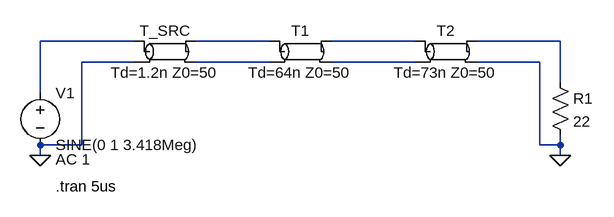
[diagram p0: schematic p3.asc]
p3.asc, the LTspice schematic file:
Version 4
SHEET 1 884 680
WIRE 176 224 32 224
WIRE 384 224 272 224
WIRE 608 224 480 224
WIRE 832 224 704 224
WIRE 176 256 96 256
WIRE 384 256 272 256
WIRE 608 256 480 256
WIRE 800 256 704 256
WIRE 832 288 832 224
WIRE 32 304 32 224
WIRE 96 384 96 256
WIRE 96 384 32 384
WIRE 800 384 800 256
WIRE 832 384 832 368
WIRE 832 384 800 384
WIRE 32 400 32 384
WIRE 832 400 832 384
FLAG 32 400 0
FLAG 832 400 0
SYMBOL tline 432 240 R0
SYMATTR InstName T1
SYMATTR Value Td=64n Z0=50
SYMBOL tline 656 240 R0
SYMATTR InstName T2
SYMATTR Value Td=73n Z0=50
SYMBOL Res 816 272 R0
SYMATTR InstName R1
SYMATTR Value 22
SYMBOL tline 224 240 R0
SYMATTR InstName T_SRC
SYMATTR Value Td=1.2n Z0=50
SYMBOL Voltage 32 288 R0
WINDOW 123 24 118 Left 2
SYMATTR Value2 AC 1
SYMATTR InstName V1
SYMATTR Value SINE(0 1 3.418Meg)
SYMATTR SpiceLine Rser=50
TEXT 56 448 Left 2 !.tran 5us

The netlist it stands for:
* p3.asc
T1 N002 N005 N003 N006 Td=64n Z0=50
T2 N003 N006 N004 0 Td=73n Z0=50
R1 N004 0 22
T_SRC N001 0 N002 N005 Td=1.2n Z0=50
V1 N001 0 SINE(0 1 3.418Meg) AC 1 Rser=50
.tran 5us
.backanno
.end